# EasyEDA Pro project 探针圆盘.eprj

# Schematic 原理图
Board Name: 探针; Create Date: 2024-04-22; Page Name: 主控MCU; Project Name: 探针圆盘; Schematic Name: 原理图; Update Date: 2025-06-17; Company: 嘉立创EDA; Page Size: A3; Version: V1.0
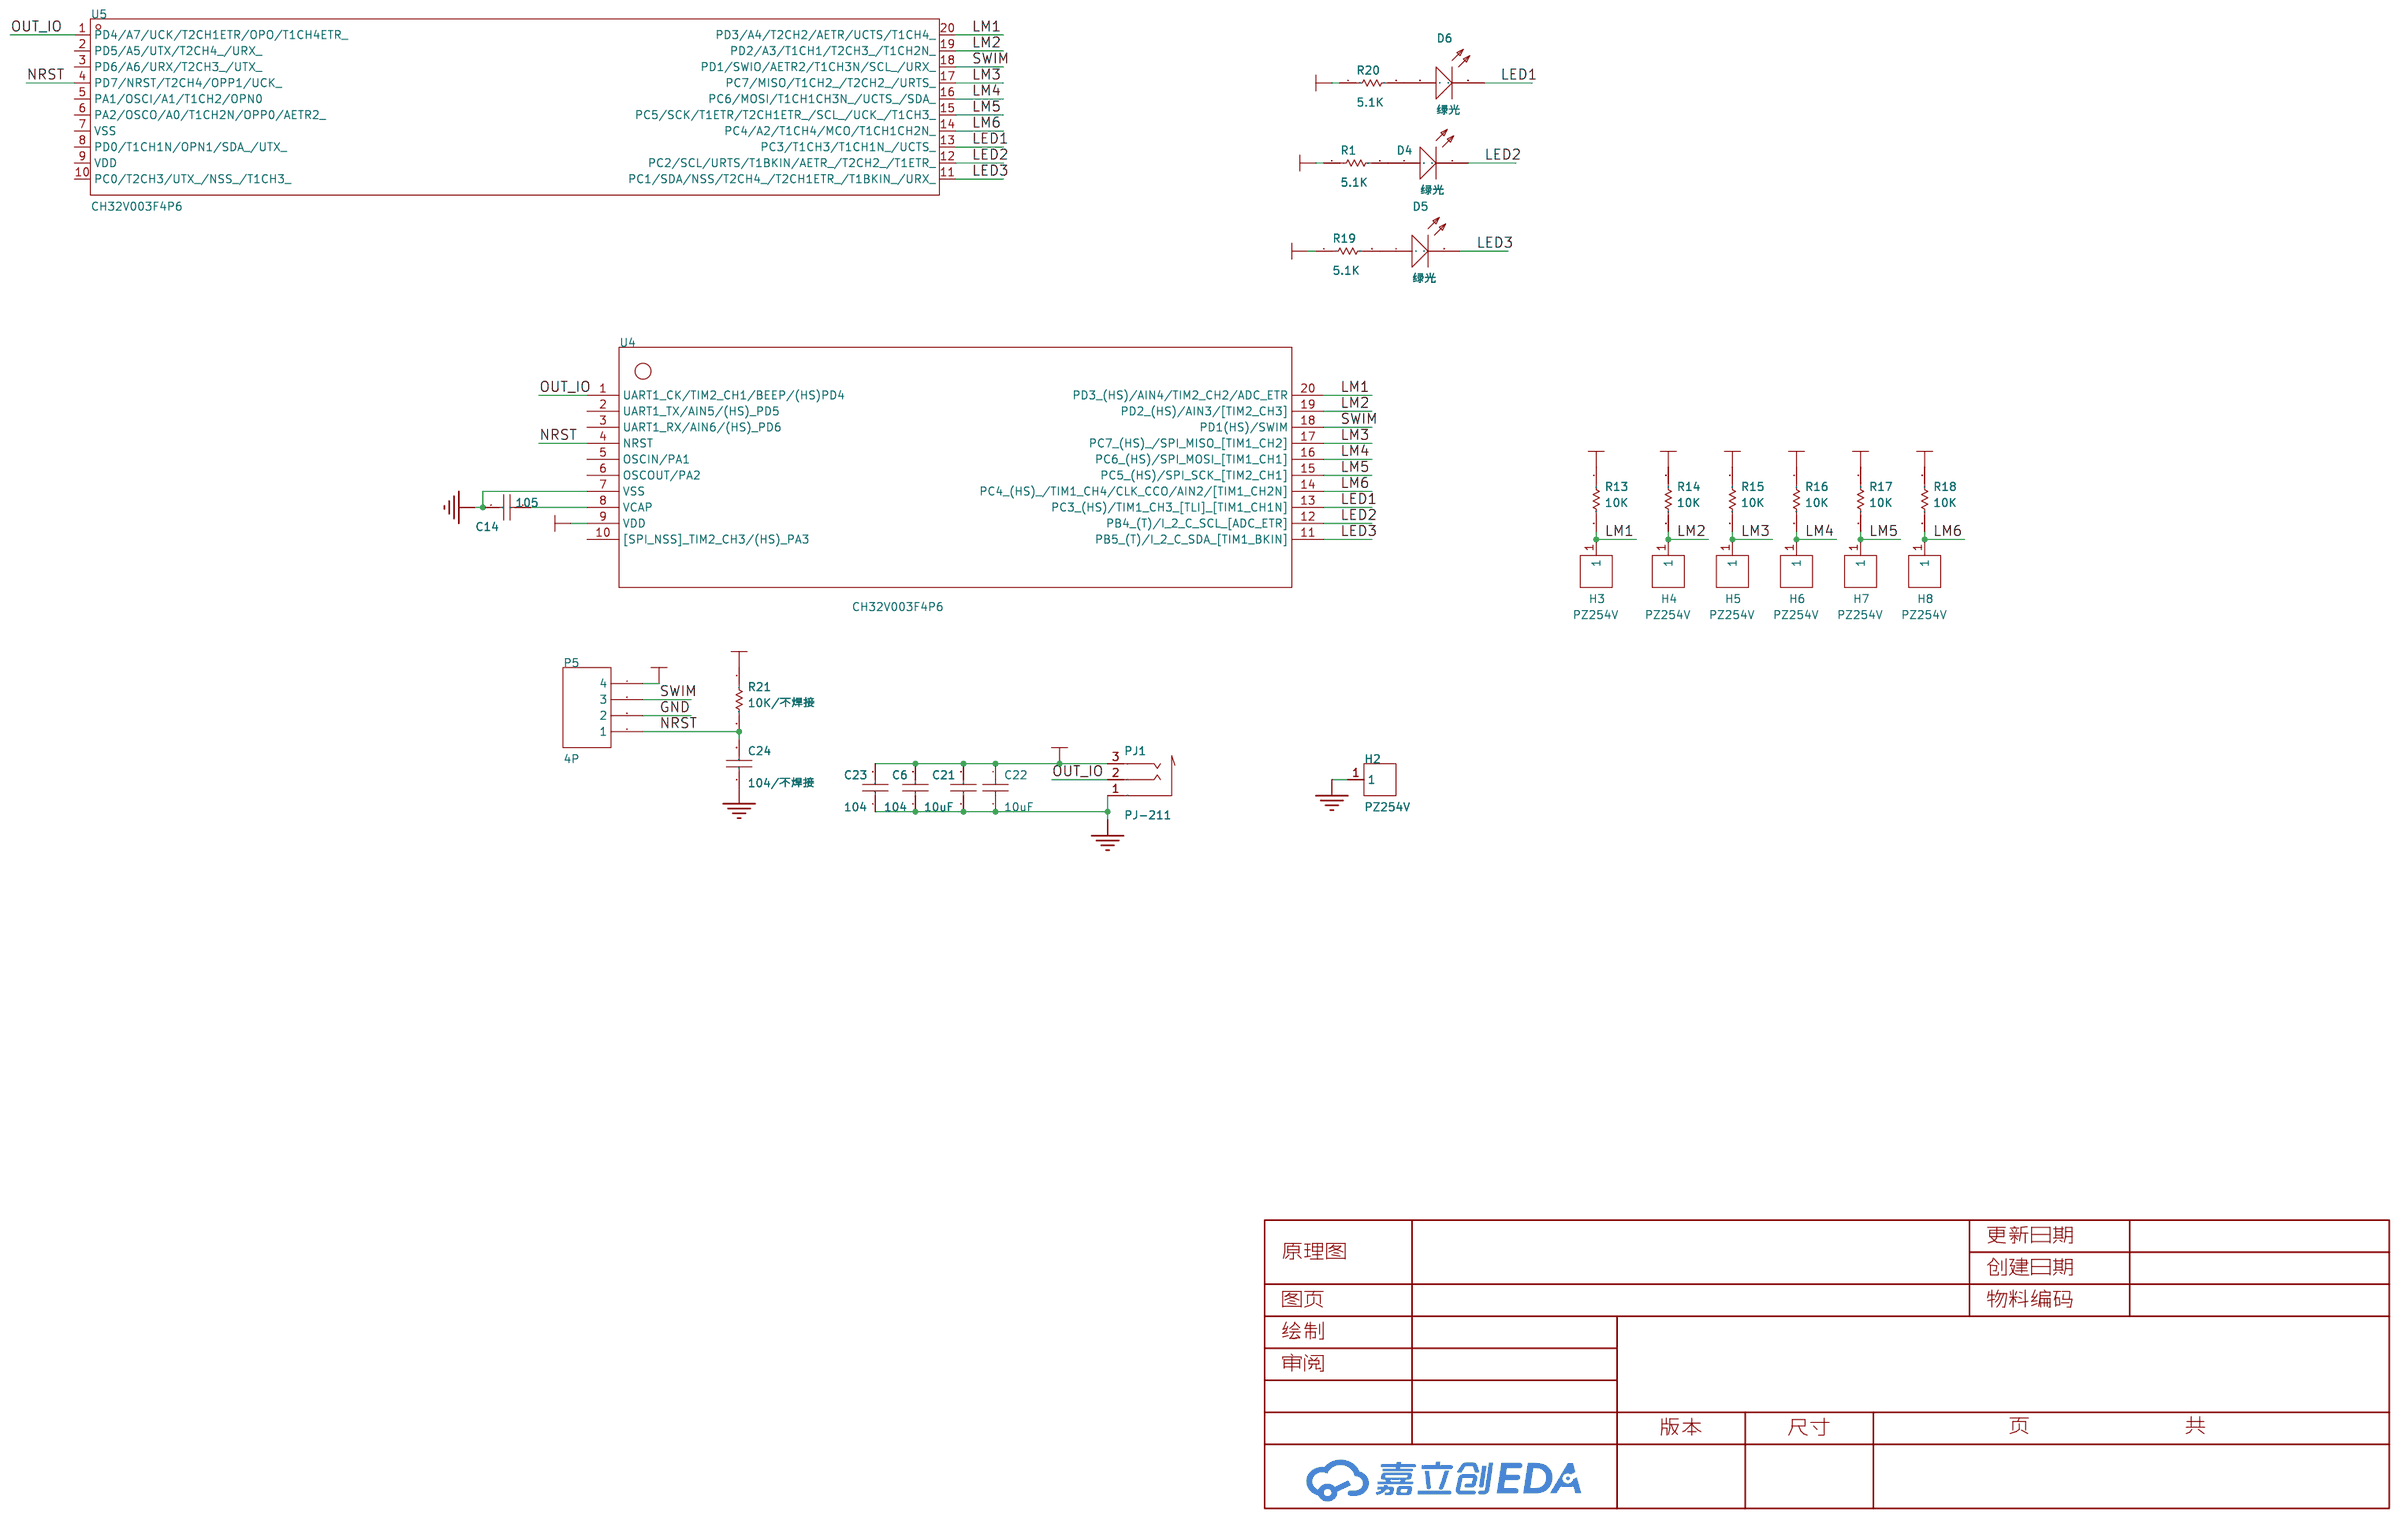
[diagram p0: schematic sheet]

## Parts
C6  104  [0603C]
C14  105  [0603C]
C21  10uF  [C1206]
C22  10uF  [C1206]
C23  104  [0603C]
C24  104/不焊接  [0603C]
D4  绿光  [0603LED]
D5  绿光  [0603LED]
D6  绿光  [0603LED]
H2  PZ254V  [HDR-TH_1P-PZ254V-11-01P-YL]
H3  PZ254V  [HDR-TH_1P-PZ254V-11-01P-YL]
H4  PZ254V  [HDR-TH_1P-PZ254V-11-01P-YL]
H5  PZ254V  [HDR-TH_1P-PZ254V-11-01P-YL]
H6  PZ254V  [HDR-TH_1P-PZ254V-11-01P-YL]
H7  PZ254V  [HDR-TH_1P-PZ254V-11-01P-YL]
H8  PZ254V  [HDR-TH_1P-PZ254V-11-01P-YL]
P5  4P  [SIP4]
PJ1  PJ-211  [AUDIO-TH_PJ-211]
R1  5.1K  [0603R]
R13  10K  [0603R]
R14  10K  [0603R]
R15  10K  [0603R]
R16  10K  [0603R]
R17  10K  [0603R]
R18  10K  [0603R]
R19  5.1K  [0603R]
R20  5.1K  [0603R]
R21  10K  [0603R]
U4  CH32V003F4P6  [TSSOP-20_L6.5-W4.4-P0.65-LS6.4-BL]
U5  CH32V003F4P6  [TSSOP-20_L6.5-W4.4-P0.65-LS6.4-BL]

## Library data of the parts
C6 C23 C24 = 104: Capacitor (Semiconductor SIM Model); Published: 8-Jun-2000; LatestRevisionDate: 17-Jul-2002; LatestRevisionNote: Re-released for DXP Platform.; PackageReference: C1206; Publisher: Altium Limited; Origin Footprint 2: C1206; Origin Footprint 3: 0402; Origin Footprint 4: 1310[0504]; Origin Footprint 5: 1608[0603]; Origin Footprint 6: C1210; Origin Footprint 7: C0805; Origin Footprint 8: C1206; Origin Footprint 9: 0805; Origin Footprint 10: 0805L; Design Item ID: Cap Semi; Library Name: Miscellaneous Devices
C14 = 104: Capacitor (Semiconductor SIM Model); Published: 8-Jun-2000; LatestRevisionDate: 17-Jul-2002; LatestRevisionNote: Re-released for DXP Platform.; PackageReference: C1206; Publisher: Altium Limited; Origin Footprint 2: C1206; Origin Footprint 3: 0402; Origin Footprint 4: 1310[0504]; Origin Footprint 5: 1608[0603]; Origin Footprint 6: C1210; Origin Footprint 7: C0805; Origin Footprint 8: C1206; Origin Footprint 9: 0805; Origin Footprint 10: 0805L; Origin Footprint 11: 0805C; Design Item ID: Cap Semi; Library Name: Miscellaneous Devices
C21 C22 = 104: Design Item ID: CAP; Library Name: SCH--װ--
D4-D6 = 红光: Origin Footprint 2: LED(小); Design Item ID: LED; Library Name: SCH封装库
H2-H8 = PZ254V-11-01P-YL: Supplier Part: C41425304; Manufacturer: XFCN(兴飞); Supplier Footprint: 插件,P=2.54mm; Datasheet: https://atta.szlcsc.com/upload/public/pdf/source/20241009/C227763597A5D58F5275B212435FDB0D.pdf; Supplier: LCSC
P5 = 4P: Library Name: SCH--װ--
PJ1 = PJ-211: LCSC Part Name: 2.5mm耳机座; Supplier Part: C668603; Manufacturer: SHOU HAN(首韩); Supplier Footprint: 插件; JLCPCB Part Class: 扩展库; Datasheet: https://atta.szlcsc.com/upload/public/pdf/source/20240424/A9B1C075589DFCFC3B81D72D2B4C46E7.pdf; Supplier: LCSC; Connector Type: 2.5mm耳机座; Current Rating (Max): 500mA; Voltage Rating (Max): 30V; Contact Material: 铜; Contact Plating: 银; Operating Temperature Range: -30℃~+70℃
R1 R19 R20 = 2K: Resistor; Published: 8-Jun-2000; LatestRevisionDate: 17-Jul-2002; LatestRevisionNote: Re-released for DXP Platform.; PackageReference: AXIAL-0.3; Publisher: Altium Limited; Origin Footprint 2: AXIAL-0.3; Origin Footprint 3: R0805; Origin Footprint 4: 0805R; Design Item ID: RES; Library Name: SCH封装库
R13-R18 R21 = 10k: Resistor; Published: 8-Jun-2000; LatestRevisionDate: 17-Jul-2002; LatestRevisionNote: Re-released for DXP Platform.; PackageReference: AXIAL-0.3; Publisher: Altium Limited; Origin Footprint 2: AXIAL-0.3; Origin Footprint 3: R0805; Origin Footprint 4: 0805R; Design Item ID: RES; Library Name: SCH封装库
U4 = STM8S003F3P6TR: Supplier Part: C52717; Manufacturer: ST(意法半导体); Supplier Footprint: TSSOP-20; JLCPCB Part Class: Basic Part; Datasheet: https://atta.szlcsc.com/upload/public/pdf/source/20170914/C52717_1505374129400969196.pdf; Supplier: LCSC; Core Processor: STM8; Speed: 16MHz; Voltage - Supply (Vcc/Vdd): 2.95V~ 5.5V; Program Memory Size: 8KB; RAM Size: 1KB; EEPROM Size: 128Bytes; Number of I/O: 16; A/D: 5x10bit; PWM: 3; UART/USART: 1 USART
U5 = CH32V003F4P6: Supplier Part: C5187096; Manufacturer: WCH(南京沁恒); Supplier Footprint: TSSOP-20-175mil; JLCPCB Part Class: 扩展库; Datasheet: https://atta.szlcsc.com/upload/public/pdf/source/20240313/7AE96B00B31D73B13B4275FFAA3D04F3.pdf; Supplier: LCSC

## Nets
5V: C6.2 C21.1 C22.1 C23.2 P5.4 PJ1.3 R1.1 R13.1 R14.1 R15.1 R16.1 R17.1 R18.1 R19.1 R20.1 R21.1 U4.9(VDD)
GND: C6.1 C14.2 C21.2 C22.2 C23.1 C24.1 H2.1 P5.2 PJ1.1 U4.7(VSS)
LED1: D6.2 U4.13(PC3 (HS)/TIM1_CH3 [TLI] [TIM1_CH1N]) U5.13(PC3/T1CH3/T1CH1N_/UCTS_)
LED2: D4.2 U4.12(PB4 (T)/I 2 C_SCL [ADC_ETR]) U5.12(PC2/SCL/URTS/T1BKIN/AETR_/T2CH2_/T1ETR_)
LED3: D5.2 U4.11(PB5 (T)/I 2 C_SDA [TIM1_BKIN]) U5.11(PC1/SDA/NSS/T2CH4_/T2CH1ETR_/T1BKIN_/URX_)
LM1: H3.1 R13.2 U4.20(PD3 (HS)/AIN4/TIM2_CH2/ADC_ETR) U5.20(PD3/A4/T2CH2/AETR/UCTS/T1CH4_)
LM2: H4.1 R14.2 U4.19(PD2 (HS)/AIN3/[TIM2_CH3]) U5.19(PD2/A3/T1CH1/T2CH3_/T1CH2N_)
LM3: H5.1 R15.2 U4.17(PC7 (HS) /SPI_MISO [TIM1_CH2]) U5.17(PC7/MISO/T1CH2_/T2CH2_/URTS_)
LM4: H6.1 R16.2 U4.16(PC6 (HS)/SPI_MOSI [TIM1_CH1]) U5.16(PC6/MOSI/T1CH1CH3N_/UCTS_/SDA_)
LM5: H7.1 R17.2 U4.15(PC5 (HS)/SPI_SCK [TIM2_CH1]) U5.15(PC5/SCK/T1ETR/T2CH1ETR_/SCL_/UCK_/T1CH3_)
LM6: H8.1 R18.2 U4.14(PC4 (HS) /TIM1_CH4/CLK_CCO/AIN2/[TIM1_CH2N]) U5.14(PC4/A2/T1CH4/MCO/T1CH1CH2N_)
NRST: C24.2 P5.1 R21.2 U4.4(NRST) U5.4(PD7/NRST/T2CH4/OPP1/UCK_)
OUT_IO: PJ1.2 U4.1(UART1_CK/TIM2_CH1/BEEP/(HS)PD4) U5.1(PD4/A7/UCK/T2CH1ETR/OPO/T1CH4ETR_)
SWIM: P5.3 U4.18(PD1(HS)/SWIM) U5.18(PD1/SWIO/AETR2/T1CH3N/SCL_/URX_)
$1N76894: C14.1 U4.8(VCAP)
$1N78041: D4.1 R1.2
$1N78127: D5.1 R19.2
$1N78198: D6.1 R20.2

Not connected (* = marked no-connect by the designer): U4 2(UART1_TX/AIN5/(HS) PD5) 3(UART1_RX/AIN6/(HS) PD6) 5(OSCIN/PA1) 6(OSCOUT/PA2) 10([SPI_NSS] TIM2_CH3/(HS) PA3); U5 2(PD5/A5/UTX/T2CH4_/URX_) 3(PD6/A6/URX/T2CH3_/UTX_) 5(PA1/OSCI/A1/T1CH2/OPN0) 6(PA2/OSCO/A0/T1CH2N/OPP0/AETR2_) 7(VSS) 8(PD0/T1CH1N/OPN1/SDA_/UTX_) 9(VDD) 10(PC0/T2CH3/UTX_/NSS_/T1CH3_)

# Board PCB
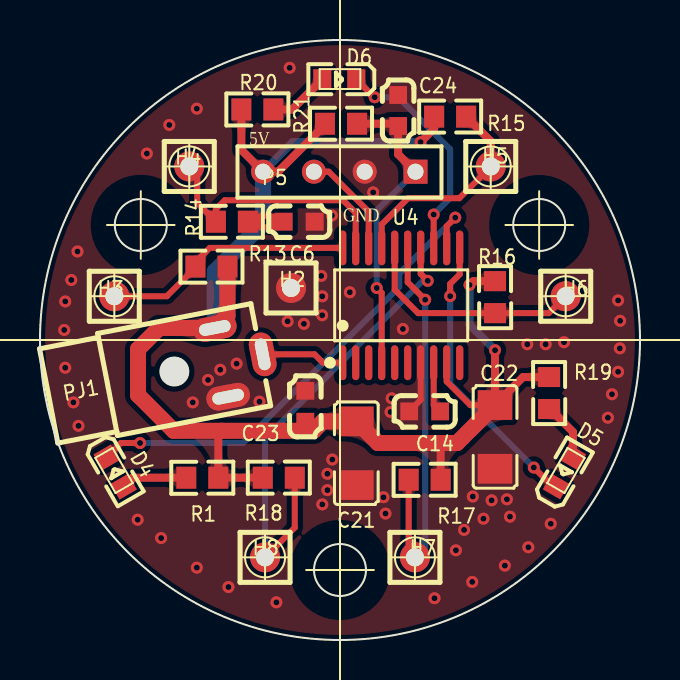
[diagram p1: board, top side]
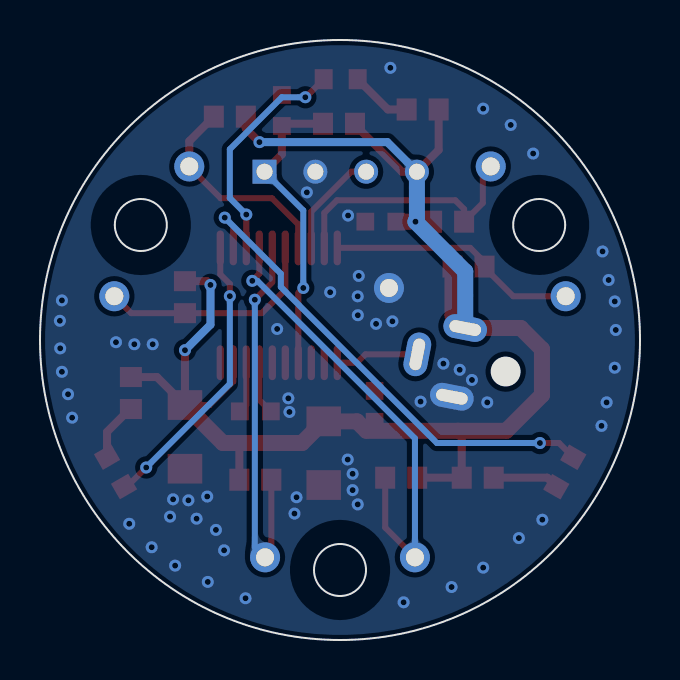
[diagram p2: board, bottom side, seen from below]

Outline 30 x 30 mm; copper layers: Top Layer, Bottom Layer. Coordinates in mm from the lower left corner of the outline.
Outline path: circle c5.04,20.75 r1.3 ; circle c15,15 r15 ; circle c15,3.5 r1.3 ; circle c24.96,20.75 r1.3
Stack: Top Layer 0.035mm / Dielectric1 1.51mm FR4 er 4.5 / Bottom Layer 0.035mm

## Design rules (mm)
template: 用户自定义配置
spacing Default (default): track to track 0.152, other pairs 0 to 0.152
track width Default (default): min 0.254, default 0.254, max 25.4
differential pair differentialPair (default): width min 0.127, default 0.254, max 2.54; gap min 0.152, default 0.152
via Default (default): diameter min 0.25, default 0.61, max 100.025; hole min 0.2, default 0.305, max 59.995

## Placement (name value [footprint] x y rotation side)
C6  104  [0603C]  12.96 20.92 180 top
C14  105  [0603C]  19.23 11.43 180 top
C21  10uF  [C1206]  15.82 9.34 270 top
C22  10uF  [C1206]  22.75 10.15 270 top
C23  104  [0603C]  13.27 11.68 270 top
C24  104/不焊接  [0603C]  17.91 26.47 270 top
D4  绿光  [0603LED]  3.73 8.42 120 top
D5  绿光  [0603LED]  26.22 8.37 240 top
D6  绿光  [0603LED]  15 28.06 0 top
H2  PZ254V  [HDR-TH_1P-PZ254V-11-01P-YL]  12.55 17.6 0 top
H3  PZ254V  [HDR-TH_1P-PZ254V-11-01P-YL]  3.72 17.19 0 top
H4  PZ254V  [HDR-TH_1P-PZ254V-11-01P-YL]  7.46 23.68 0 top
H5  PZ254V  [HDR-TH_1P-PZ254V-11-01P-YL]  22.54 23.68 0 top
H6  PZ254V  [HDR-TH_1P-PZ254V-11-01P-YL]  26.28 17.19 0 top
H7  PZ254V  [HDR-TH_1P-PZ254V-11-01P-YL]  18.75 4.13 0 top
H8  PZ254V  [HDR-TH_1P-PZ254V-11-01P-YL]  11.25 4.13 0 top
P5  4P  [SIP4]  18.77 23.41 180 top
PJ1  PJ-211  [AUDIO-TH_PJ-211]  10.1 14.08 11 top
R1  5.1K  [0603R]  8.11 8.11 180 top
R13  10K  [0603R]  8.57 18.67 180 top
R14  10K  [0603R]  9.59 20.92 180 top
R15  10K  [0603R]  20.51 26.17 0 top
R16  10K  [0603R]  22.75 17.14 270 top
R17  10K  [0603R]  19.23 8.01 180 top
R18  10K  [0603R]  11.94 8.11 0 top
R19  5.1K  [0603R]  25.46 12.35 270 top
R20  5.1K  [0603R]  10.87 26.53 0 top
R21  10K  [0603R]  15.05 25.81 0 top
U4  CH32V003F4P6  [TSSOP-20_L6.5-W4.4-P0.65-LS6.4-BL]  18.06 16.73 0 top

## Footprints (pads in the part's own frame, mm; a bottom-side part is the same pattern mirrored in y, then rotated)
0603C
  rect 0.889x0.889 smd: 1(-0.774,0) 2(0.774,0)
0603LED
  rect 0.9x1 smd: 1(-0.884,-0.017) 2(0.816,-0.017)
0603R
  rect 1x1.1 smd: 1(-0.8,0) 2(0.8,0)
AUDIO-TH_PJ-211
  oval 2.2x1.2 hole 1.6x0.6: 1(-1.05,-1.75) 3(-1.05,1.75)
  oval 1.2x2.2 hole 0.6x1.6: 2(1.05,0)
C1206
  rect 1.485x1.728 smd: 1(-1.593,0) 2(1.593,0)
HDR-TH_1P-PZ254V-11-01P-YL
  round 1.5 hole 0.9: 1(0,0)
SIP4
  rect 1.2x1.2 hole 0.8: 1(0,0)
  round 1.2 hole 0.8: 2(2.54,0) 3(5.08,0) 4(7.62,0)
TSSOP-20_L6.5-W4.4-P0.65-LS6.4-BL
  oval 0.364x1.742 smd: 1(-2.925,-2.871) 2(-2.275,-2.871) 3(-1.625,-2.871) 4(-0.975,-2.871) 5(-0.325,-2.871) 6(0.325,-2.871) 7(0.975,-2.871) 8(1.625,-2.871) 9(2.275,-2.871) 10(2.925,-2.871) 11(2.925,2.871) 12(2.275,2.871) 13(1.625,2.871) 14(0.975,2.871) 15(0.325,2.871) 16(-0.325,2.871) 17(-0.975,2.871) 18(-1.625,2.871) 19(-2.275,2.871) 20(-2.925,2.871)

## Nets
As in the schematic.

Pads without a net: U4 2 3 5 6 10

## Via types
v1: diameter 0.6, hole 0.3, Top Layer to Bottom Layer, 72 vias

## Routing (per net, layer and track width the routed paths; a pad name or vN(x,y) marks a point on that pad's centre or on a via; arc(x,y) is an arc through that point)
5V: length 79.8
  Top Layer w0.3: U4.9 20.34,12.93 21.52,11.75 C22.1
  Top Layer w0.4: R16.1 21.66,17.94 v1(21.48,17.75) ; 9.1,10.46 8.91,10.28 R1.1 11.14,8.11 ; R15.1 19.71,25.57 v1(19.03,24.89) ; R20.1 10.07,24.5 P5.4 11.9,23.41 14.25,25.76 R21.1 ; 20.02,9.85 20.03,9.83 R17.1 ; v1(22.75,14.49) C22.1 24.15,13.15 R19.1
  Top Layer w0.8: 9.37,18.67 9.37,16.23 PJ1.3 5.96,15.6 4.9,14.54 4.9,12.25 6.69,10.46 13.68,10.46 14.15,10.93 C21.1 16.9,9.85 20.85,9.85 C22.1 ; C6.2 v1(11.23,20.92) R14.1
  Bottom Layer w0.4: v1(22.75,14.49) 21.48,15.77 v1(21.48,17.75) ; v1(19.03,24.89) 12.63,24.89 P5.4
  Bottom Layer w0.8: PJ1.3 8.74,18.43 v1(11.23,20.92) 11.15,20.99 P5.4
GND: length 2.7
  Top Layer w0.3: U4.7 19.03,12.01 18.46,11.43
  vias: v1(1.21,15.5) v1(1.26,16.93) v1(1.26,13.61) v1(1.57,18) v1(1.67,11.88) v1(1.87,19.43) v1(1.93,10.71) v1(4.88,6.02) v1(5.34,24.32) v1(6.06,5.1) v1(6.46,25.75) v1(7.64,11.88) v1(7.84,26.57) v1(7.84,3.62) v1(8.4,13) v1(9.01,13.51) v1(9.42,2.65) v1(9.83,13.82) v1(10.97,11.92) v1(11.82,1.88) v1(12.38,15.93) v1(12.48,28.61) v1(13.2,15.81) v1(14.06,18.2) v1(14.11,17.18) v1(14.11,16.24) v1(14.11,6.78) v1(14.37,8.31) v1(14.37,7.49) v1(14.6,21.22) v1(14.61,9.02) v1(15.49,17.39) v1(16.66,22.38) v1(17.17,7.14) v1(17.28,6.32) v1(17.53,11.4) v1(17.58,12.08) v1(18.14,15.55) v1(19.72,2.09) v1(20.8,4.48) v1(21.2,5.5) v1(21.61,2.9) v1(21.64,7.17) v1(22.17,6.07) v1(22.58,6.98) v1(23.24,3.72) v1(23.35,7.03) v1(23.5,6.17) v1(24.37,14.79) v1(24.42,4.64) v1(25.28,14.79) v1(25.54,5.81) v1(26.2,14.89) v1(28.39,11.11) v1(28.6,12.29) v1(28.9,16.98) v1(28.9,13.41) v1(29.01,15.96) v1(28.99,14.58)
LED1: length 11.4
  Top Layer w0.3: D6.2 16.72,27.14 v1(16.73,27.14) ; U4.13 v1(19.69,21.27)
  Bottom Layer w0.3: v1(19.69,21.27) 20.51,22.1 20.51,24.54 17.91,27.14 v1(16.73,27.14)
LED2: length 24.5
  Top Layer w0.3: D4.2 4.05,9.85 v1(5,9.85) ; U4.12 20.34,20.69 v1(20.76,21.12)
  Bottom Layer w0.3: v1(20.76,21.12) 17.96,18.31 17.96,17.65 10.16,9.85 v1(5,9.85)
LED3: length 14.4
  Top Layer w0.3: D5.2 25.64,7.67 v1(24.69,8.62) ; U4.11 20.99,18.28 20.51,17.8 v1(20.51,17.19)
  Bottom Layer w0.3: v1(24.69,8.62) 20.51,12.81 v1(20.51,17.19)
LM1: length 12.6
  Top Layer w0.3: H3.1 6.34,17.19 7.77,18.62 R13.2 7.77,18.89 8.49,19.6 U4.20
LM2: length 13.1
  Top Layer w0.3: U4.19 15.78,21.35 15.15,21.99 9.24,21.99 8.79,21.54 R14.2 7.86,21.85 7.86,23.28 H4.1
LM3: length 10.8
  Top Layer w0.3: U4.17 17.09,20.78 18.4,22.09 20.97,22.09 22.54,23.66
  Top Layer w0.4: H5.1 22.54,24.94 R15.2
LM4: length 11.5
  Top Layer w0.3: H6.1 25.44,16.34 R16.2 18.91,16.34 17.74,17.52 U4.16
LM5: length 20.1
  Top Layer w0.3: U4.15 18.38,17.89 v1(19.26,17.01) ; H7.1 18.43,4.45 R17.2
  Bottom Layer w0.3: H7.1 19.26,4.65 v1(19.26,17.01)
LM6: length 23.7
  Top Layer w0.3: 12.74,8.11 12.74,5.62 H8.1 ; U4.14 19.03,18.31 v1(19.39,17.96)
  Bottom Layer w0.3: H8.1 11.25,10.08 19.13,17.96 v1(19.39,17.96)
NRST: length 15.2
  Top Layer w0.3: v1(16.84,17.6) 17.09,17.35 U4.4
  Top Layer w0.4: R21.2 17.8,25.81 C24.2 17.91,24.28 P5.1
  Bottom Layer w0.3: v1(16.84,17.6) 16.84,21.48 P5.1
OUT_IO: length 4.2
  Top Layer w0.3: PJ1.2 13.73,14.28 14.15,13.86 U4.1
SWIM: length 5.4
  Top Layer w0.3: P5.3 14.44,23.41 16.44,21.42 U4.18
$1N76894: length 2.6
  Top Layer w0.3: U4.8 19.69,11.75 C14.1
$1N78041: length 3.3
  Top Layer w0.4: D4.1 4.64,8.11 R1.2
$1N78127: length 2.9
  Top Layer w0.4: R19.2 25.5,11.55 26.65,10.41 D5.1
$1N78198: length 3.1
  Top Layer w0.4: D6.1 12.6,26.53 R20.2

## Copper pours and planes (outline as drawn; the poured copper is in the pictures)
GND on Top Layer: -2.09,31.07 30.86,31.07 30.86,-0.86 -2.09,-0.86
GND on Bottom Layer: -1.28,31.07 31.12,31.07 31.12,-0.91 -1.28,-0.91

Small or netless copper shapes (teardrops, artwork), in the pictures only: 84 on Top Layer, 18 on Bottom Layer

## Text on the board
Top Silkscreen Layer: 5V | GND
